# Altium schematic sheet CONTROL.SchDoc
size A; SheetNumber: 1; SheetTotal: 1
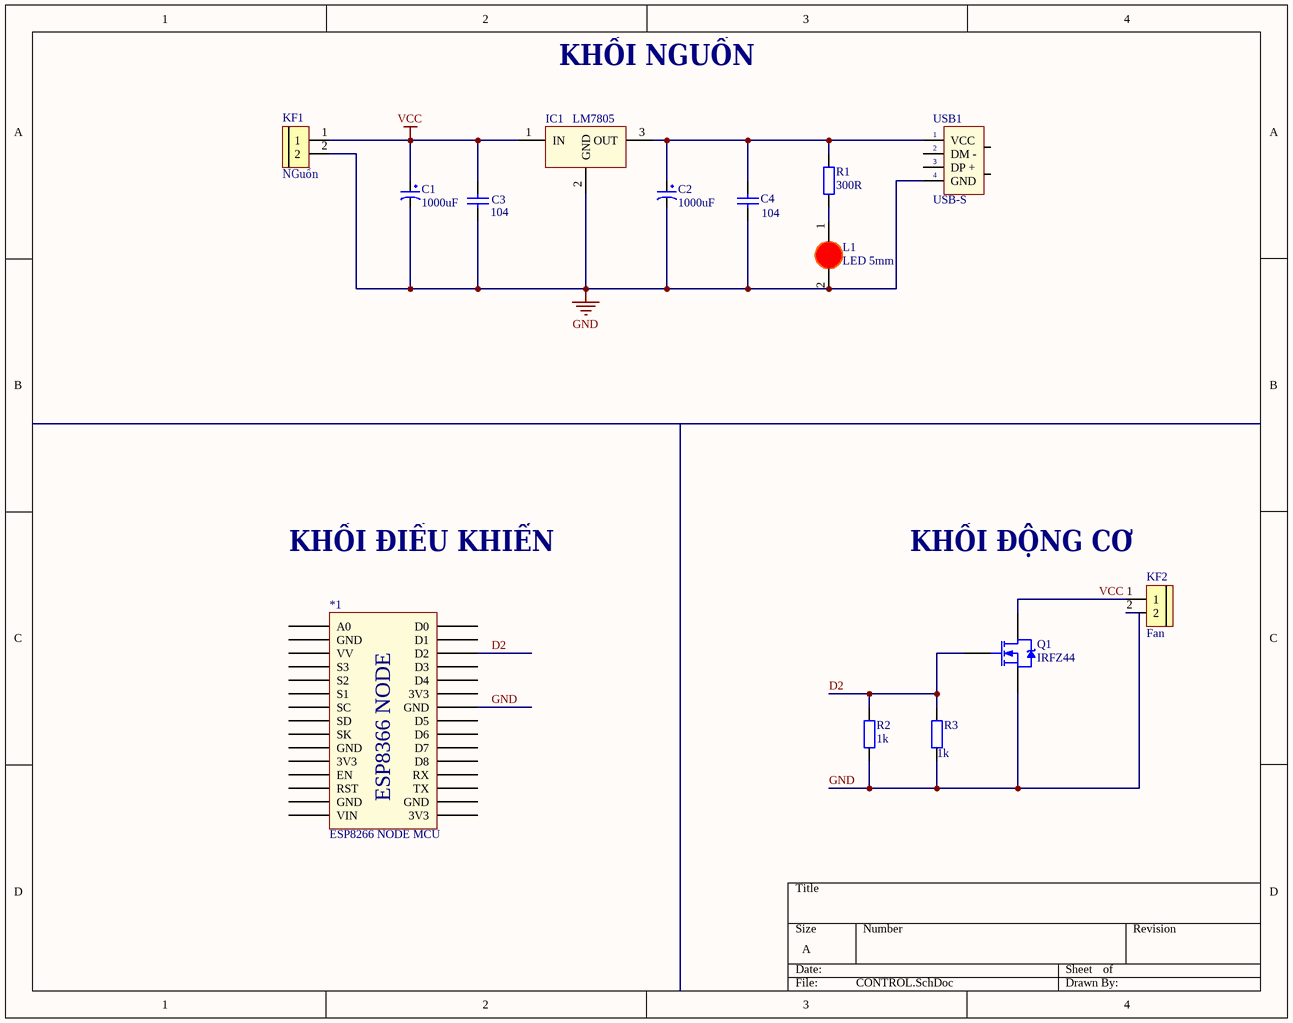
[diagram p0: CONTROL.SchDoc]

## Parts
*1  ESP8266 NODE MCU  [ESP8266 NODE MCU]
C1  1000uF  [tu hoa 10mm]
C2  1000uF  [tu hoa 10mm]
C3  104  [tu gom]
C4  104  [tu gom]
IC1  LM7805  [QTO-220]
KF1  NGuồn  [Con 2 KF301 5.08]
KF2  Fan  [Con 2 KF301 5.08]
L1  LED 5mm  [LED-5MM-RED]
Q1  IRFZ44  [TO220]
R1  300R  [tro vach 1/4w]
R2  1k  [tro vach 1/2w]
R3  1k  [tro vach 1/2w]
USB1  USB-S  [USB-S1]

## Nets
GND: *1.24(GND) C1.2 C2.2 C3.1 C4.1 IC1.2(GND) KF1.2 KF2.2 L1.2(K) Q1.3(S) R2.1 R3.1 USB1.4(GND)
VCC: C1.1 C3.2 IC1.1(IN) KF1.1 KF2.1 Q1.2(D)
D2: *1.28(D2) Q1.1(G) R2.2 R3.2
NetC2_1: C2.1 C4.2 IC1.3(OUT) R1.2 USB1.1(VCC)
NetL1_1: L1.1(A) R1.1

Not connected (* = marked no-connect by the designer): *1 1(A0) 2(GND) 3(VV) 4(S3) 5(S2) 6(S1) 7(SC) 8(SD) 9(SK) 10(GND) 11(3V3) 12(EN) 13(RST) 14(GND) 15(VIN) 16(3V3) 17(GND) 18(TX) 19(RX) 20(D8) 21(D7) 22(D6) 23(D5) 25(3V3) 26(D4) 27(D3) 29(D1) 30(D0); USB1 2(DM_-) 3(DP_+) 5 6

## Notes on the sheet
- KHỐI NGUỒN
- KHỐI ĐIỀU KHIỂN
- KHỐI ĐỘNG CƠ
- (in symbol ESP8266 NODE MCU) ESP8366 NODE

## Library data of the parts
C1 C2 = Tu Hoa 1000uF 10V 10x12: Cắm; So_Chan: 2; Don_Vi: Con; Ten_Linh_Kien: Tụ Hóa 1000uF 10V 10x12MM; Ma_Hang: MH006614; Kieu_Chan: *; Chung_Loai: Cắm
C3 C4 = Tu gom 104 50V: Cắm; So_Chan: 2; Ten_Linh_Kien: Tụ gốm 104 100nF 50V; Don_Vi: Con; Ma_Hang: MH004761; Chung_Loai: Cắm; Kieu_Chan: *
IC1 = LM78xx: On ap +, from + 5 to + 24VDC; Value: LM7805
KF1 KF2 = CON 2 KF301: Cắm; Ma_Hang: MH000987; Ten_Linh_Kien: CON 2 KF301-2P 5.08MM Xanh Dương; Don_Vi: Con; Chung_Loai: Cắm; Ghi_Chu: *; Kieu_Chan: *
L1 = LED 5mm Do: Cắm; Don_Vi: Con; Ma_Hang: MH008967; Ten_Linh_Kien: Led 5MM Phủ Đỏ (1000c); Ghi_Chu: *; Kieu_Chan: *; Chung_Loai: Cắm
Q1 = FET IRFZ44 DIP: TO-220
R1 = Tro Vach 1/4W 5% 300R: Cắm; So_Chan: 2; Ten_Linh_Kien: Trở Vạch 1/4w 5% 300R; Ma_Hang: MH007309; Don_Vi: Con; Chung_Loai: Cắm; Kieu_Chan: *
R2 R3 = Tro Vach 1/2W 5% 1k: Cắm; Don_Vi: Con; So_Chan: 2; Ten_Linh_Kien: Trở 5% 1/2w 1K; Ma_Hang: MH007240; Chung_Loai: Cắm; Kieu_Chan: *
USB1 = USB_S: USB connector; Value: USB